# EasyEDA schematic tripwire-alarm.json
TITLE: Sheet_1; REV: 1.0; Date: 2021-02-02; Sheet: 1/1; Drawn By: Stefan Feltmann; Company: Your Company
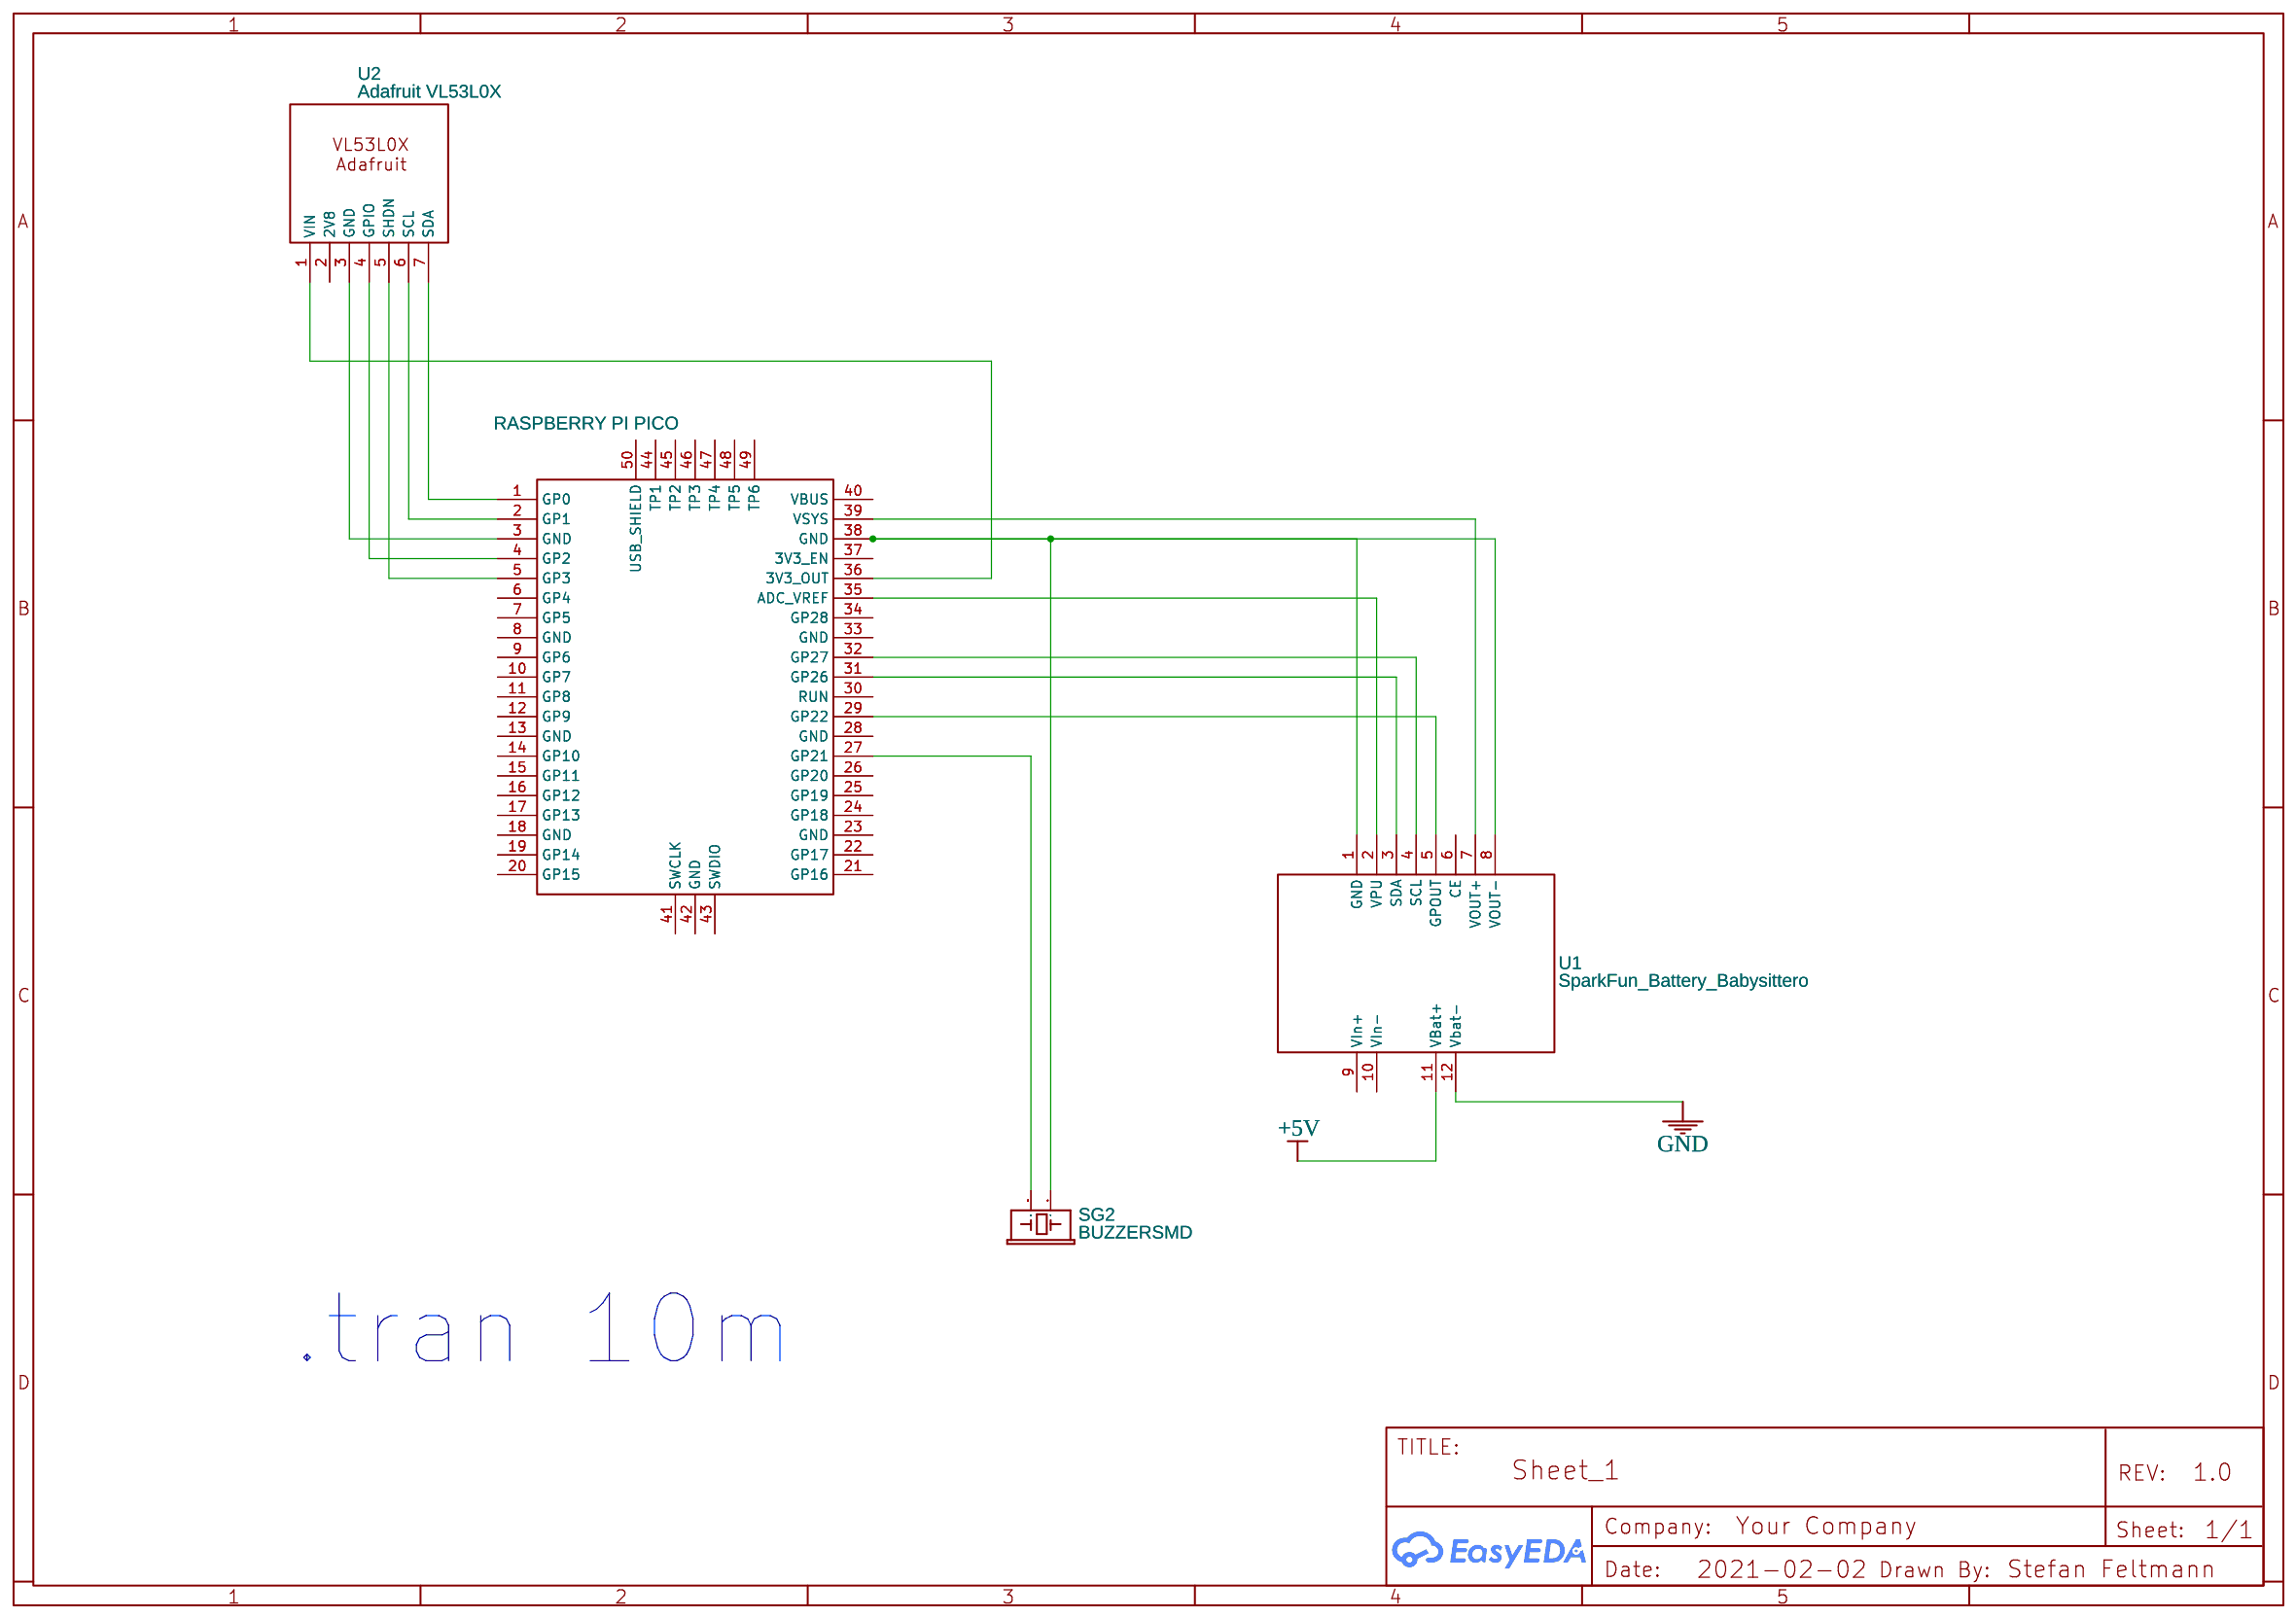
[diagram p0: schematic sheet]

## Parts
GP1  RASPBERRY PI PICO  [RASPBERRY PI PICO]
SG2  BUZZERSMD  [BUZZER-CMT1603]
U1  SparkFun_Battery_Babysittero  [SPARKFUN_BATTERY_BABYSITTERSERI]
U2  Adafruit VL53L0X  [ADAFRUIT VL53L0X]

## Library data of the parts
GP1 = RASPBERRY PI PICO: Manufacturer: Raspberry Pi Foundation; Manufacturer Part: RPi Pico; Supplier: Raspberry Pi Foundation; Supplier Part: RPi Pico; link: https://www.raspberrypi.org/products/raspberry-pi-pico/specifications/; Contributor: PolishFuze
SG2 = BUZZERSMD: Buzzer 12mm; Contributor: SparkFun
U1 = SparkFun_Battery_Babysittero: Manufacturer Part: SparkFun; Contributor: Eduardo Solis
U2 = Adafruit VL53L0X: Manufacturer: Adafruit; Manufacturer Part: 3317; link: https://cdn-learn.adafruit.com/downloads/pdf/adafruit-vl53l0x-micro-lidar-distance-sensor-breakout.pdf; Contributor: DanielAG

## Nets
+5V: U1.11(VBat+)
GND: U1.12(Vbat-)
Net-(GP1-1): GP1.1(GP0) U2.7(SDA)
Net-(GP1-2): GP1.2(GP1) U2.6(SCL)
Net-(GP1-3): GP1.3(GND) U2.3(GND)
Net-(GP1-4): GP1.4(GP2) U2.4(GPIO)
Net-(GP1-5): GP1.5(GP3) U2.5(SHDN)
Net-(GP1-27): GP1.27(GP21) SG2.P$2(2)
Net-(GP1-29): GP1.29(GP22) U1.5(GPOUT)
Net-(GP1-31): GP1.31(GP26) U1.3(SDA)
Net-(GP1-32): GP1.32(GP27) U1.4(SCL)
Net-(GP1-35): GP1.35(ADC_VREF) U1.2(VPU)
Net-(GP1-36): GP1.36(3V3_OUT) U2.1(VIN)
Net-(GP1-38): GP1.38(GND) SG2.P$1(1) U1.1(GND) U1.8(VOUT-)
Net-(GP1-39): GP1.39(VSYS) U1.7(VOUT+)

Not connected (* = marked no-connect by the designer): GP1 6(GP4) 7(GP5) 8(GND) 9(GP6) 10(GP7) 11(GP8) 12(GP9) 13(GND) 14(GP10) 15(GP11) 16(GP12) 17(GP13) 18(GND) 19(GP14) 20(GP15) 21(GP16) 22(GP17) 23(GND) 24(GP18) 25(GP19) 26(GP20) 28(GND) 30(RUN) 33(GND) 34(GP28) 37(3V3_EN) 40(VBUS) 41(SWCLK) 42(GND) 43(SWDIO) 44(TP1) 45(TP2) 46(TP3) 47(TP4) 48(TP5) 49(TP6) 50(USB_SHIELD); U1 6(CE) 9(VIn+) 10(VIn-); U2 2(2V8)

## Notes on the sheet
- .tran 10m
